# Altium schematic sheet Micro.SchDoc
size 431 x 279 mm; Organization: Altium Limited; Address1: L3, 12a Rodborough Rd; Address2: Frenchs Forest; Address3: NSW; Address4: Australia 2086; SheetNumber: 7; SheetTotal: 7
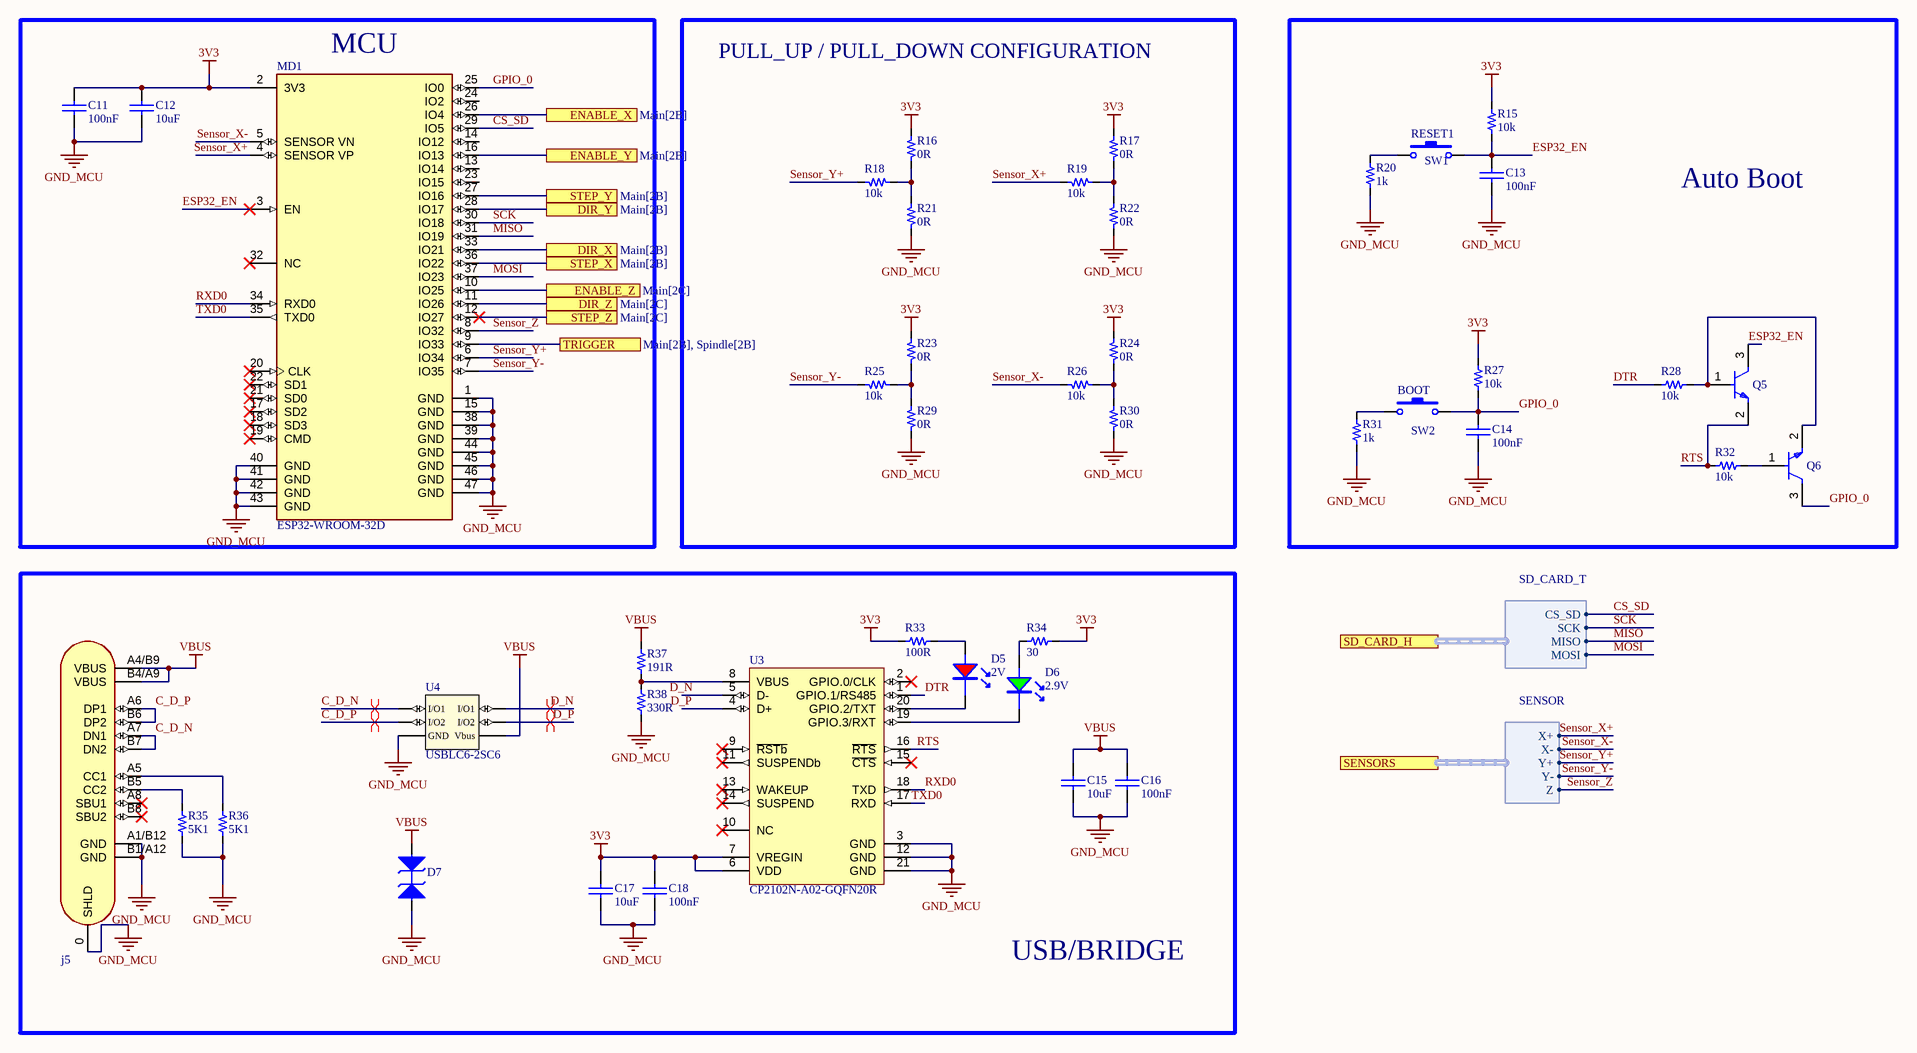
[diagram p0: Micro.SchDoc]

## Parts
C11  value 100nF  [0603_cap]  (hidden comment: CAP CER 100nF 50V X7R 0603)
C12  value 10uF  [0603_cap]  (hidden comment: 10uF 10V)
C13  value 100nF  [0603_cap]  (hidden comment: CAP CER 100nF 50V X7R 0603)
C14  value 100nF  [0603_cap]  (hidden comment: CAP CER 100nF 50V X7R 0603)
C15  value 10uF  [0603_cap]  (hidden comment: 10uF 10V)
C16  value 100nF  [0603_cap]  (hidden comment: CAP CER 100nF 50V X7R 0603)
C17  value 10uF  [0603_cap]  (hidden comment: 10uF 10V)
C18  value 100nF  [0603_cap]  (hidden comment: CAP CER 100nF 50V X7R 0603)
D5  2V  [0805_LED]
D6  2.9V  [0805_LED]
D7  TVS 12V  [SOD_123FL]  (value not drawn)
j5  USB C  [CON_USB_C_16P_RA]  (value not drawn)
MD1  ESP32-WROOM-32D  [MOD_ESP32-WROOM-32_EXP]
Q5  TRANS NPN 40V 200mA SOT-23  [SOT_23_3]  (value not drawn)
Q6  TRANS NPN 40V 200mA SOT-23  [SOT_23_3]  (value not drawn)
R15  value 10k  [0603_res]  (hidden comment: 10k 1/10W)
R16  value 0R  [0603_res]  (hidden comment: 0R 1/10W)
R17  value 0R  [0603_res]  (hidden comment: 0R 1/10W)
R18  value 10k  [0603_res]  (hidden comment: 10k 1/10W)
R19  value 10k  [0603_res]  (hidden comment: 10k 1/10W)
R20  value 1k  [0603_res]  (hidden comment: 1k 1/10W)
R21  value 0R  [0603_res]  (hidden comment: 0R 1/10W)
R22  value 0R  [0603_res]  (hidden comment: 0R 1/10W)
R23  value 0R  [0603_res]  (hidden comment: 0R 1/10W)
R24  value 0R  [0603_res]  (hidden comment: 0R 1/10W)
R25  value 10k  [0603_res]  (hidden comment: 10k 1/10W)
R26  value 10k  [0603_res]  (hidden comment: 10k 1/10W)
R27  value 10k  [0603_res]  (hidden comment: 10k 1/10W)
R28  value 10k  [0603_res]  (hidden comment: 10k 1/10W)
R29  value 0R  [0603_res]  (hidden comment: 0R 1/10W)
R30  value 0R  [0603_res]  (hidden comment: 0R 1/10W)
R31  value 1k  [0603_res]  (hidden comment: 1k 1/10W)
R32  value 10k  [0603_res]  (hidden comment: 10k 1/10W)
R33  value 100R  [0603_res]  (hidden comment: 100R 1/10W)
R34  value 30  [0603_res]  (hidden comment: RES 30Ω ±5% 100mW 0603)
R35  value 5K1  [0603_res]  (hidden comment: RES 5.1kΩ ±1% 100mW 0603)
R36  value 5K1  [0603_res]  (hidden comment: RES 5.1kΩ ±1% 100mW 0603)
R37  value 191R  [0603_res]  (hidden comment: 191R 1/10W)
R38  value 330R  [0603_res]  (hidden comment: 330R 1/10W)
SW1  Sw  [Sw_PUSH_4.5x4.5x5mm]  (value not drawn)
SW2  Sw  [Sw_PUSH_4.5x4.5x5mm]  (value not drawn)
U3  CP2102N-A02-GQFN20R  [WFQFN_20_EP_3X3MM]
U4  USBLC6-2SC6  [SOT_23_6]

## Blocks framed on the sheet
MCU: C11 C12 MD1
PULL_UP / PULL_DOWN CONFIGURATION: R16-R19 R21-R26 R29 R30
Auto Boot: C13 C14 Q5 Q6 R15 R20 R27 R28 R31 R32 SW1 SW2
USB/BRIDGE: C15-C18 D5-D7 j5 R33-R38 U3 U4

## Ports
DIR_X (see Main[2B]), DIR_Y (see Main[2B]), DIR_Z (see Main[2C]), ENABLE_X (see Main[2B]), ENABLE_Y (see Main[2B]), ENABLE_Z (see Main[2C]), SD_CARD_H (harness SD_CARD_T, see Main[2C], MicroSD_Card[3B]), SENSORS (harness SENSOR, see Main[2B], Sensors[4C]), STEP_X (see Main[2B]), STEP_Y (see Main[2B]), STEP_Z (see Main[2C]), TRIGGER (see Main[2B], Spindle[2B])

## Harnesses
SD_CARD_T: SCK, MISO, MOSI, CS_SD
SENSOR: X-, Y+, Y-, X+, Z

## Nets
3V3: C11.1 C12.1 C17.1 C18.1 MD1.2(3V3) R15.2 R16.1 R17.1 R23.1 R24.1 R27.2 R33.1 R34.2 U3.6(VDD) U3.7(VREGIN)
GND_MCU: C11.2 C12.2 C13.2 C14.2 C15.2 C16.2 C17.2 C18.2 D7.2 j5.0(SHLD) j5.A1/B12(GND) j5.B1/A12(GND) MD1.1(GND) MD1.15(GND) MD1.38(GND) MD1.39(GND) MD1.40(GND) MD1.41(GND) MD1.42(GND) MD1.43(GND) MD1.44(GND) MD1.45(GND) MD1.46(GND) MD1.47(GND) R20.1 R21.1 R22.1 R29.1 R30.1 R31.1 R35.1 R36.1 R38.1 U3.3(GND) U3.12(GND) U3.21(GND) U4.2(GND)
VBUS: C15.1 C16.1 D7.1 j5.A4/B9(VBUS) j5.B4/A9(VBUS) R37.2 U4.5(Vbus)
C_D_N: j5.A7(DN1) j5.B7(DN2) U4.1(I/O1)
C_D_P: j5.A6(DP1) j5.B6(DP2) U4.3(I/O2)
CS_SD: MD1.29(IO5) ; port SD_CARD_H.CS_SD
D_N: U3.5(D-) U4.6(I/O1)
D_P: U3.4(D+) U4.4(I/O2)
DIR_X: MD1.33(IO21) ; port DIR_X
DIR_Y: MD1.28(IO17) ; port DIR_Y
DIR_Z: MD1.11(IO26) ; port DIR_Z
DTR: R28.2 U3.1(GPIO.1/RS485)
ENABLE_X: MD1.26(IO4) ; port ENABLE_X
ENABLE_Y: MD1.16(IO13) ; port ENABLE_Y
ENABLE_Z: MD1.10(IO25) ; port ENABLE_Z
ESP32_EN: C13.1 MD1.3(EN) Q5.3(C) R15.1 SW1.2
GPIO_0: C14.1 MD1.25(IO0) Q6.3(C) R27.1 SW2.2
MISO: MD1.31(IO19) ; port SD_CARD_H.MISO
MOSI: MD1.37(IO23) ; port SD_CARD_H.MOSI
RTS: Q5.2(E) R32.2 U3.16(~{RTS})
RXD0: MD1.34(RXD0) U3.18(TXD)
SCK: MD1.30(IO18) ; port SD_CARD_H.SCK
Sensor_X+: MD1.4(SENSOR_VP) R19.2 ; port SENSORS.X+
Sensor_X-: MD1.5(SENSOR_VN) R26.2 ; port SENSORS.X-
Sensor_Y+: MD1.6(IO34) R18.2 ; port SENSORS.Y+
Sensor_Y-: MD1.7(IO35) R25.2 ; port SENSORS.Y-
Sensor_Z: MD1.8(IO32) ; port SENSORS.Z
STEP_X: MD1.36(IO22) ; port STEP_X
STEP_Y: MD1.27(IO16) ; port STEP_Y
STEP_Z: MD1.12(IO27) ; port STEP_Z
TRIGGER: MD1.9(IO33) ; port TRIGGER
TXD0: MD1.35(TXD0) U3.17(RXD)
NetD5_1: D5.1(A) R33.2
NetD5_2: D5.2 U3.20(GPIO.2/TXT)
NetD6_1: D6.1(A) R34.1
NetD6_2: D6.2 U3.19(GPIO.3/RXT)
Netj5_A5: j5.A5(CC1) R36.2
Netj5_B5: j5.B5(CC2) R35.2
NetQ5_1: Q5.1(B) Q6.2(E) R28.1
NetQ6_1: Q6.1(B) R32.1
NetR16_2: R16.2 R18.1 R21.2
NetR17_2: R17.2 R19.1 R22.2
NetR20_2: R20.2 SW1.1
NetR23_2: R23.2 R25.1 R29.2
NetR24_2: R24.2 R26.1 R30.2
NetR31_2: R31.2 SW2.1
NetR37_1: R37.1 R38.2 U3.8(VBUS)

Not connected (* = marked no-connect by the designer): j5 A8(SBU1)* B8(SBU2)*; MD1 13(IO14) 14(IO12) 17(SD2)* 18(SD3)* 19(CMD)* 20(CLK)* 21(SD0)* 22(SD1)* 23(IO15) 24(IO2) 32(NC)*; U3 2(GPIO.0/CLK)* 9(~{RSTb})* 10(NC)* 11(SUSPENDb)* 13(WAKEUP)* 14(SUSPEND)* 15(~{CTS})*

## Layout directives
differential pair: C_D_N, C_D_P, D_N, D_P

## Notes on the sheet
- (near SW1) RESET1
- (near SW2) BOOT
- DWG. NO.
- REV.
- SHT.
- THIS DOCUMENT AND THE DATA DISCLOSED HEREIN OR HEREWITH IS THE PROPERTY OF ALTIUM LIMITED AND MAY BE FREELY DISTRIBUTED IN WHOLE. NO RIGHTS ARE RESERVED OR EXPRESS OR IMPLIED WARANTEE GIVEN.
- REVISION
- DESCRIPTION
- DATE
- APPROVED
- ENG:
- APPROVALS
- PROJECT
- DSN:
- CHK:
- REFERENCE DOCUMENTS
- PROJECT REVISION:
- TITLE
- DOCUMENT REVISION:
- DESIGN ITEM:
- BOM:
- FAB DWG:
- PCB DWG:
- ASSY DWG:
- SCALE:
- SIZE
- B
- CAGE CODE
- FILE NAME
- DWG NO.
- SHEET
- OF
- REV

## Library data of the parts
C11 C13 C14 C16 C18 = Cap_100nF_0603_50V: 50V 100nF X7R ±10% 0603 Ceramic Capacitors RoHS; Manufacturer: FOJAN; Manufacturer Part Number: FCC0603B104K500CT; Supplier 1: LCSC; Supplier Part Number 1: C5137636; ComponentLink1Description: LCSC; ComponentLink1URL: https://www.lcsc.com/product-detail/C5137636.html
C12 C15 C17 = Cap_10uF_0603_10V: 10V 10uF X5R ±10% 0603 Multilayer Ceramic Capacitors MLCC - SMD/SMT ROHS; Manufacturer: CCTC; Manufacturer Part Number: TCC0603X5R106K100CT; Supplier 1: LCSC; Supplier Part Number 1: C380314; ComponentLink1Description: LCSC; ComponentLink1URL: https://www.lcsc.com/product-detail/Multilayer-Ceramic-Capacitors-MLCC-SMD-SMT_CCTC-TCC0603X5R106K100CT_C380314.html
D5 = LED_0805_RED: LED RED CLEAR 0805 SMD; Manufacturer: XINGLIGHT; Manufacturer Part Number: XL-2012SURC; Supplier 1: LCSC; Supplier Part Number 1: C965812; ComponentLink1Description: LCSC; ComponentLink1URL: https://www.lcsc.com/product-detail/Light-Emitting-Diodes-LED_XINGLIGHT-XL-2012SURC_C965812.html
D6 = LED_0805_Green: LED GREEN CLEAR 0805 SMD; Manufacturer: XINGLIGHT; Manufacturer Part Number: XL-2012UGC; Supplier 1: LCSC; Supplier Part Number 1: C965815; ComponentLink1Description: LCSC; ComponentLink1URL: https://www.lcsc.com/product-detail/Light-Emitting-Diodes-LED_XINGLIGHT-XL-2012UGC_C965815.html
D7 = TVS_5V_1CH_BID_SOD_123FL: 21.7A 200W@10/1000us 9.2V 7V Bidirectional 5V SOD-123FL ESD and Surge Protection (TVS/ESD) ROHS; Manufacturer: TDSEMIC; Manufacturer Part Number: SMF5.0CA; Supplier 1: LCSC; Supplier Part Number 1: C46956338; ComponentLink1Description: LCSC; ComponentLink1URL: https://lcsc.com/product-detail/ESD-and-Surge-Protection-TVS-ESD_TDSEMIC-SMF5-0CA_C46956338.html
j5 = CON_USB_TYPEC_16P: 3A USB 3.1 1 Surface Mount 16P Female -40℃~+85℃ Type-C SMD USB Connectors ROHS; Manufacturer: SHOU HAN; Manufacturer Part Number: TYPE-C-3.1-16PIN; Supplier 1: LCSC; Supplier Part Number 1: C7507405; ComponentLink1Description: LCSC; ComponentLink1URL: https://lcsc.com/product-detail/USB-Connectors_SHOU-HAN-TYPE-C-3-1-16PIN_C7507405.html
MD1 = CMP-194065-000003-1: WIFI MODULE 32MBITS SPI FLASH; Manufacturer: ESPRESSIF; Manufacturer Part Number: ESP32-WROOM-32-N4; ComponentLink2URL: https://www.espressif.com/sites/default/files/documentation/esp32-wroom-32d_esp32-wroom-32u_datasheet_en.pdf; ComponentLink2Description: Datasheet; ComponentLink3Description: LCSC; ComponentLink3URL: https://www.lcsc.com/product-detail/C82899.html?s_z=n_ESP32%2520WROOM%2520N4; Supplier 1: LCSC; Supplier Part Number 1: C82899
Q5 Q6 = BJT_N_MMBT3904-7-F: 40V 310mW 200mA NPN SOT-23 Single Bipolar Transistors RoHS; Manufacturer: DIODES; Manufacturer Part Number: MMBT3904-7-F; Supplier 1: LCSC; Supplier Part Number 1: C94514; ComponentLink1Description: LCSC; ComponentLink1URL: https://www.lcsc.com/product-detail/C94514.html?s_z=n_MMBT3904-7-F
R15 R18 R19 R25-R28 R32 = Res_10k_0603_1/10W: RES SMD 10k OHM 5% 1/10W 0603; Manufacturer: FOJAN; Manufacturer Part Number: FRC0603J103TS; ComponentLink1URL: https://www.lcsc.com/product-detail/Chip-Resistor-Surface-Mount_FOJAN-FRC0603J103TS_C2930027.html; Supplier 1: LCSC; Supplier Part Number 1: C2930027; ComponentLink1Description: LCSC
R16 R17 R21-R24 R29 R30 = Res_0R_0603_1/10W: RES SMD 0R OHM 5% 1/10W 0603; Manufacturer: FOJAN; Manufacturer Part Number: FRC0603P000 TS; ComponentLink1URL: https://www.lcsc.com/product-detail/Chip-Resistor-Surface-Mount_FOJAN-FRC0603P000-TS_C2907080.html; Supplier 1: LCSC; Supplier Part Number 1: C2907080; ComponentLink1Description: LCSC
R20 R31 = Res_1k_0603_1/10W: RES SMD 1k OHM 5% 1/10W 0603; Manufacturer: FOJAN; Manufacturer Part Number: FRC0603J102 TS; ComponentLink1URL: https://www.lcsc.com/product-detail/Chip-Resistor-Surface-Mount_FOJAN-FRC0603J102-TS_C2907113.html; Supplier 1: LCSC; Supplier Part Number 1: C2907113; ComponentLink1Description: LCSC
R33 = Res_100R_0603_1/10W: RES SMD 100R OHM 5% 1/10W 0603; Manufacturer: FOJAN; Manufacturer Part Number: FRC0603J101 TS; ComponentLink1URL: https://www.lcsc.com/product-detail/Chip-Resistor-Surface-Mount_FOJAN-FRC0603J101-TS_C2907089.html; Supplier 1: LCSC; Supplier Part Number 1: C2907089; ComponentLink1Description: LCSC
R34 = Res_30_0603_1/10W: 100mW 30Ω 75V ±100ppm/℃ Thick Film Resistor ±5% 0603 Chip Resistor - Surface Mount RoHS; Manufacturer: FOJAN; Manufacturer Part Number: FRC0603J300 TS; ComponentLink1URL: https://www.lcsc.com/product-detail/Chip-Resistor-Surface-Mount_FOJAN-FRC0603J102-TS_C2907113.html; Supplier 1: LCSC; Supplier Part Number 1: C2907150; ComponentLink1Description: LCSC
R35 R36 = Res 5K1: 100mW 5.1kΩ 75V ±100ppm/℃ Thick Film Resistor ±1% 0603 Chip Resistor - Surface Mount RoHS; Manufacturer: FOJAN; Manufacturer Part Number: FRC0603F5101TS; ComponentLink1URL: https://www.lcsc.com/product-detail/C2907044.html?s_z=n_5.1k%2520resistor; Supplier 1: LCSC; Supplier Part Number 1: C2907044; ComponentLink1Description: LCSC
R37 = Res_191R_0603_1/10W: 100mW Thick Film Resistor 75V ±100ppm/℃ ±1% 191Ω 0603 Chip Resistor - Surface Mount ROHS; Manufacturer: FOJAN; Manufacturer Part Number: FRC0603F1910TS; ComponentLink1URL: https://lcsc.com/product-detail/Chip-Resistor-Surface-Mount_FOJAN-FRC0603F1910TS_C3000718.html; Supplier 1: LCSC; Supplier Part Number 1: C3000718; ComponentLink1Description: LCSC
R38 = Res_330R_0603_1/10W: RES SMD 330R OHM 5% 1/10W 0603; Manufacturer: FOJAN; Manufacturer Part Number: FRC0603J331 TS; ComponentLink1URL: https://www.lcsc.com/product-detail/Chip-Resistor-Surface-Mount_FOJAN-FRC0603J331-TS_C2907152.html; Supplier 1: LCSC; Supplier Part Number 1: C2907152; ComponentLink1Description: LCSC
SW1 SW2 = Sw_PUSH_4.5x4.5x5.0xmm: SWITCH TACTILE SPST-NO 0.05A 12V; Manufacturer: BZCN; Manufacturer Part Number: TSC015A05026A; Supplier 1: LCSC; Supplier Part Number 1: C2888509; Last modified by: N-A.Potosi; Last modified date: 20190222; ComponentLink1Description: LCSC; ComponentLink1URL: https://www.lcsc.com/product-detail/Tactile-Switches_BZCN-TSC015A05026A_C2888509.html
U3 = IC_SGL_USB2UART-BRIDGE_20QFN: IC USB TO UART BRIDGE QFN20; Manufacturer: Silicon Labs; Manufacturer Part Number: CP2102N-A02-GQFN20R; Supplier 1: LCSC; Supplier Part Number 1: C969913; ComponentLink1Description: LCSC; ComponentLink1URL: https://www.lcsc.com/product-detail/USB-ICs_SILICON-LABS-CP2102N-A02-GQFN20R_C969913.html
U4 = TVS_5.25V_2CH_SOT_23_6: TVS DIODE 5.25V 17V SOT23-6; Manufacturer: STMicroelectronics; ComponentLink1Description: LCSC; ComponentLink1URL: https://www.lcsc.com/product-detail/ESD-Protection-Devices_STMicroelectronics-USBLC6-2SC6_C7519.html; Supplier 1: LCSC; Manufacturer Part Number: USBLC6-2SC6; Supplier Part Number 1: C7519